# EAGLE design SSTuino (EAGLE 9.2.1)
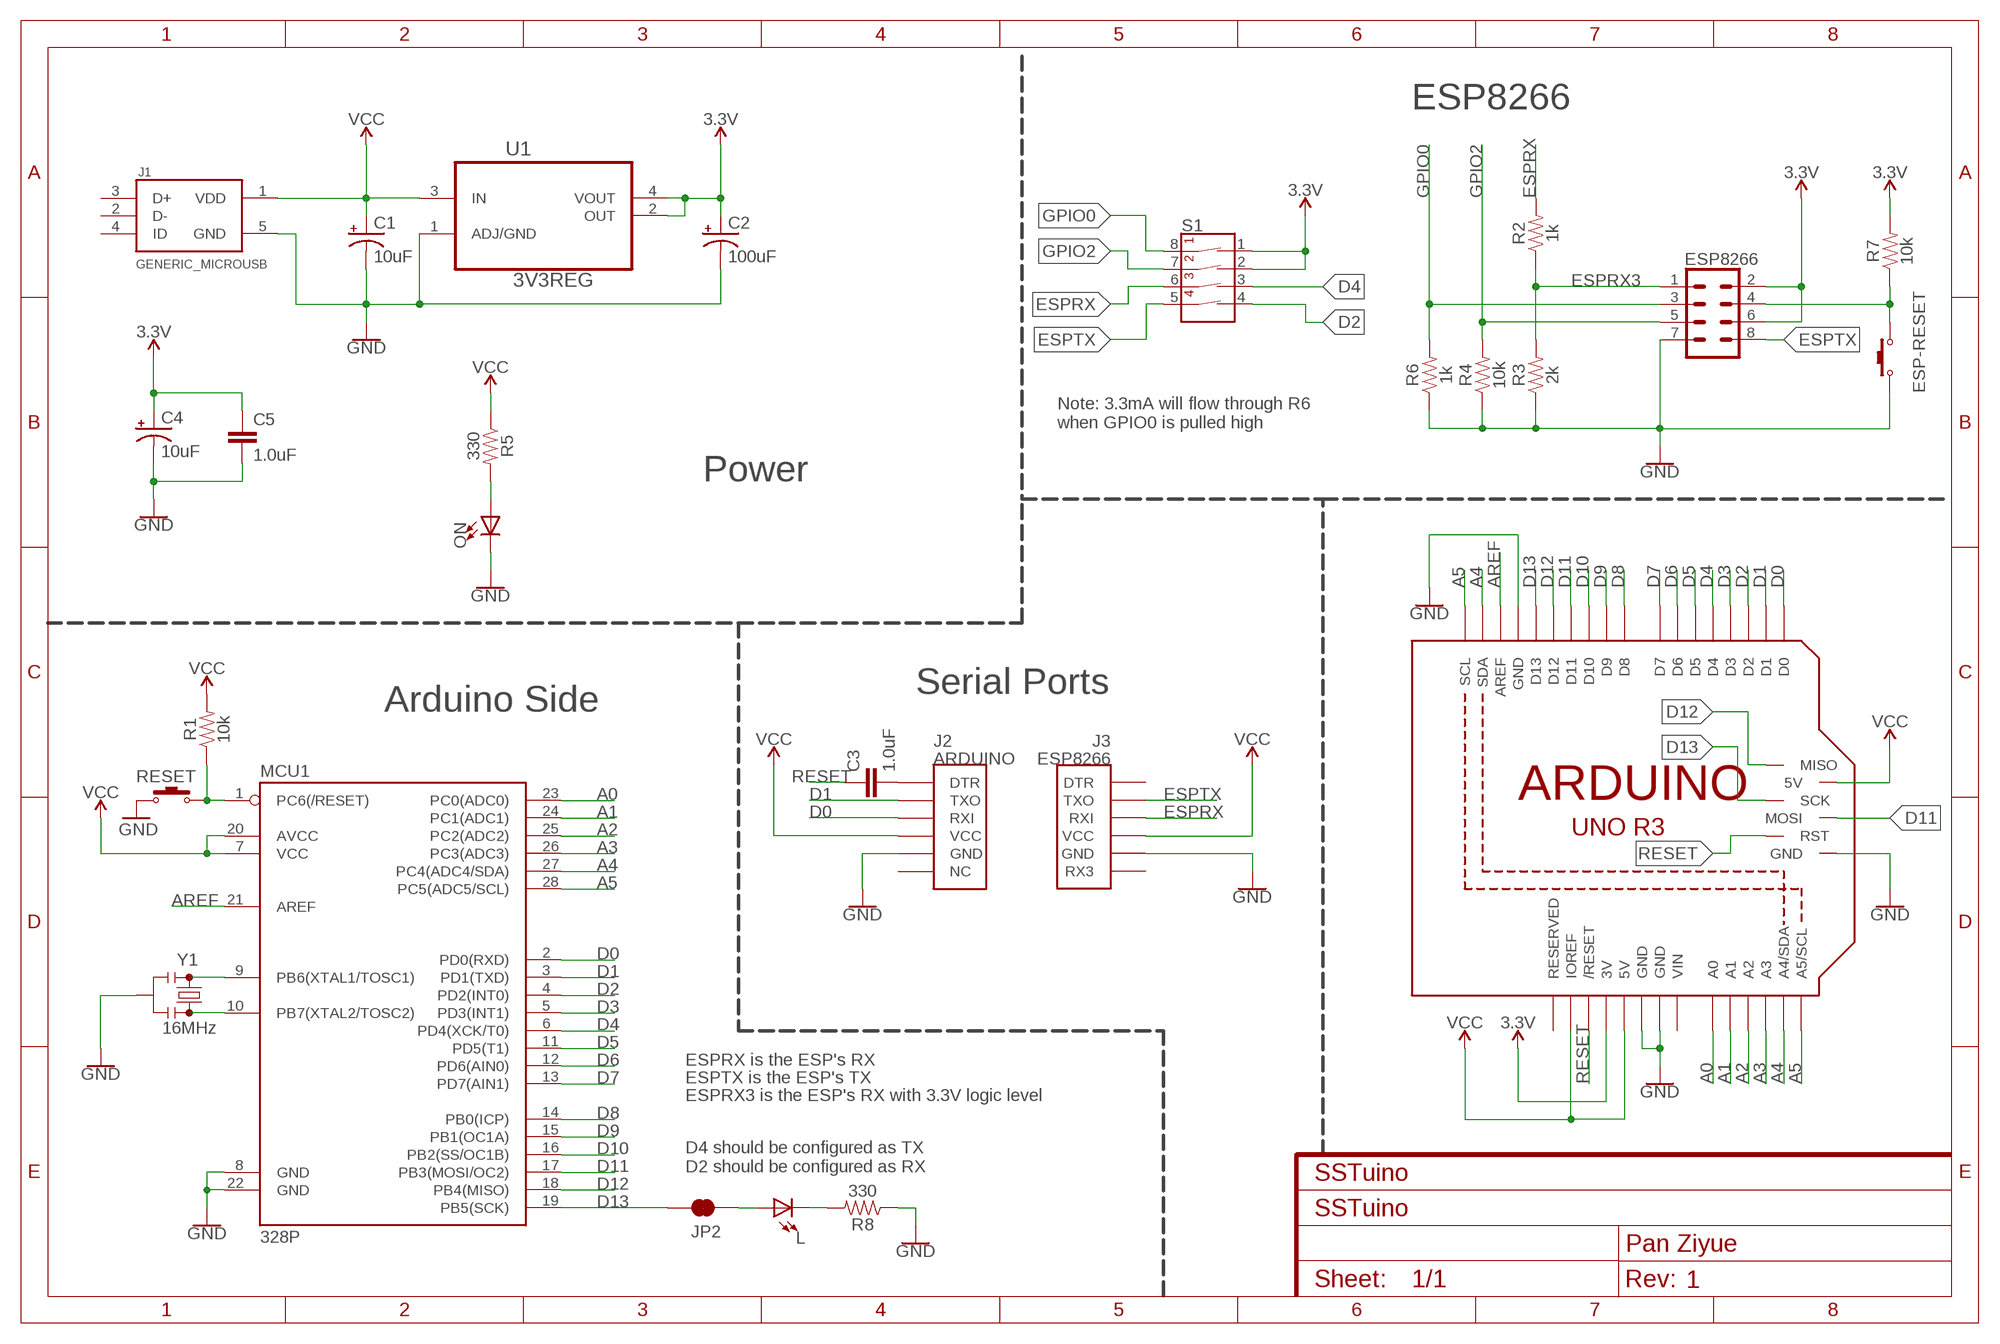
[diagram p0: schematic, sheet 1]
FRAME1 (FRAME-A4L): CNAME: SSTuino; CREVISION: 1; DESIGNER: Pan Ziyue; SPICEPREFIX: X

## Parts
C1  10uF  10UF-POLAR-EIA3528-20V-10%(TANT)  [EIA3528]
C2  100uF  100UF-POLAR-25V-20%(ELEC)  [PANASONIC_D]
C3  1.0uF  1.0UF-1206-50V-10%  [1206]
C4  10uF  10UF-POLAR-EIA3216-16V-10%(TANT)  [EIA3216]
C5  1.0uF  1.0UF-1206-50V-10%  [1206]
ESP8266  CONN_04X2  [2X4]
ESP-RESET  SW-PB_(KAN0641)  [S-SP-4N-KAN0641]
J1  GENERIC_MICROUSB  [FRAMATOME_10118194-0001LF]
J2  ARDUINO  CP2102_DEVICEMICROUSB  [CP2102_DEVICE_MICROUSB]
J3  ESP8266  CP2102_DEVICE_ESP8266  [CP2102_DEVICE_MICROUSB_ESP8266]
JP2  JUMPER-SMT_2_NC_TRACE_SILK  [SMT-JUMPER_2_NC_TRACE_SILK]
L  LED3MM  [LED3MM]
M1  ARDUINO_R3_ICSPSST  [ARDUINOR3_ISCP_SST]
MCU1  328P  ATMEGA328P_PDIP  [DIP28]
ON  LED3MM  [LED3MM]
R1  10k  RESISTOR1206  [1206]
R2  1k  RESISTOR1206  [1206]
R3  2k  RESISTOR1206  [1206]
R4  10k  RESISTOR1206  [1206]
R5  330  RESISTOR1206  [1206]
R6  1k  RESISTOR1206  [1206]
R7  10k  RESISTOR1206  [1206]
R8  330  RESISTOR1206  [1206]
RESET  SW-PB_(KAN0641)  [S-SP-4N-KAN0641]
S1  DIP-04SMD  [DIPSWITCH-04-SMD]
U1  3V3REG  LM1117MP-3.3  [SOT230P696X180-4N]
Y1  16MHz  RESONATOR-16MHZSMD_3.2X1.3  [RESONATOR-SMD-3.2X1.3]

## Nets
3.3V: C2.+ C4.+ C5.1 ESP8266.2 ESP8266.6 M1.3V R7.2 S1.1(1A) S1.2(2A) U1.2(OUT) U1.4(VOUT)
A0: M1.A0 MCU1.23(PC0(ADC0))
A1: M1.A1 MCU1.24(PC1(ADC1))
A2: M1.A2 MCU1.25(PC2(ADC2))
A3: M1.A3 MCU1.26(PC3(ADC3))
A4: M1.A4(A4/SDA) M1.SDA MCU1.27(PC4(ADC4/SDA))
A5: M1.A5(A5/SCL) M1.SCL MCU1.28(PC5(ADC5/SCL))
AREF: M1.AREF MCU1.21(AREF)
D0: J2.RXI M1.D0 MCU1.2(PD0(RXD))
D1: J2.TXO M1.D1 MCU1.3(PD1(TXD))
D2: M1.D2 MCU1.4(PD2(INT0)) S1.4(4A)
D3: M1.D3 MCU1.5(PD3(INT1))
D4: M1.D4 MCU1.6(PD4(XCK/T0)) S1.3(3A)
D5: M1.D5 MCU1.11(PD5(T1))
D6: M1.D6 MCU1.12(PD6(AIN0))
D7: M1.D7 MCU1.13(PD7(AIN1))
D8: M1.D8 MCU1.14(PB0(ICP))
D9: M1.D9 MCU1.15(PB1(OC1A))
D10: M1.D10 MCU1.16(PB2(SS/OC1B))
D11: M1.D11 M1.MOSI MCU1.17(PB3(MOSI/OC2))
D12: M1.D12 M1.MISO MCU1.18(PB4(MISO))
D13: JP2.2 M1.D13 M1.SCK MCU1.19(PB5(SCK))
DTR: C3.2 J2.DTR
ESPRESET: ESP8266.4 ESP-RESET.3 ESP-RESET.4 R7.1
ESPRX: J3.P$4(RXI) R2.2 S1.6(3B)
ESPRX3: ESP8266.1 R2.1 R3.2
ESPTX: ESP8266.8 J3.P$3(TXO) S1.5(4B)
GND: C1.C(-) C2.- C4.- C5.2 ESP8266.7 ESP-RESET.1 ESP-RESET.2 J1.5(GND) J2.GND J3.P$5(GND) M1.GND M1.GND@1(GND) M1.GND@2(GND) M1.GND@3(GND) MCU1.8(GND) MCU1.22(GND) ON.K(C) R3.1 R4.1 R6.1 R8.1 RESET.1 RESET.2 U1.1(ADJ/GND) Y1.2
GPIO0: ESP8266.3 R6.2 S1.8(1B)
GPIO2: ESP8266.5 R4.2 S1.7(2B)
N$1: MCU1.10(PB7(XTAL2/TOSC2)) Y1.3
N$2: L.K(C) R8.2
N$3: JP2.1 L.A
N$4: ON.A R5.2
N$5: MCU1.9(PB6(XTAL1/TOSC1)) Y1.1
RESET: C3.1 M1.RESET(/RESET) M1.RESET_ICSP(RST) MCU1.1(PC6(/RESET)) R1.1 RESET.3 RESET.4
VCC: C1.A(+) J1.1(VDD) J2.5V(VCC) J3.P$6(VCC) M1.5V M1.5V_ICSP(5V) M1.IOREF MCU1.7(VCC) MCU1.20(AVCC) R1.2 R5.1 U1.3(IN)
Unconnected: J1.2(D-) J1.3(D+) J1.4(ID) J2.3V(NC) J3.P$1(RX3) J3.P$2(DTR) M1.RESERVED

## Notes on the sheet
- ESP8266
- Note: 3.3mA will flow through R6 
  when GPIO0 is pulled high
- Power
- Serial Ports
- Arduino Side
- ESPRX is the ESP's RX
- ESPTX is the ESP's TX
- ESPRX3 is the ESP's RX with 3.3V logic level
- D4 should be configured as TX
  D2 should be configured as RX

## Power pins joined to a net without a drawn wire
VIN: M1.VIN

## Library data of the parts
C1 = SparkFun-Capacitors:10UF-POLAR: 10.0µF polarized capacitors A capacitor is a passive two-terminal electrical component used to store electrical energy temporarily in an electric field.; PROD_ID: CAP-08063
C2 = SparkFun-Capacitors:100UF-POLAR: 100µF polarized capacitors A capacitor is a passive two-terminal electrical component used to store electrical energy temporarily in an electric field.; PROD_ID: CAP-12547
C3 = SparkFun-Capacitors:1.0UF: 1µF ceramic capacitors A capacitor is a passive two-terminal electrical component used to store electrical energy temporarily in an electric field.; PROD_ID: CAP-09822
C4 = SparkFun-Capacitors:10UF-POLAR: 10.0µF polarized capacitors A capacitor is a passive two-terminal electrical component used to store electrical energy temporarily in an electric field.; PROD_ID: CAP-00811
C5 = SparkFun-Capacitors:1.0UF: 1µF ceramic capacitors A capacitor is a passive two-terminal electrical component used to store electrical energy temporarily in an electric field.; PROD_ID: CAP-09822; SPICEPREFIX: C
ESP8266 = SparkFun-Connectors:CONN_04X2: Multi connection point. Often used as Generic Header-pin footprint for 0.1 inch spaced/style header connections On any of the 0.1 inch spaced packages, you can populate with these: Break Away Headers - Straight <https://www.sparkfun.com/products/116> (PRT-00116) Break Away Male Headers - Right Angle <https://www.sparkfun.com/products/553> (PRT-00553) Female Headers <https://www.sparkfun.com/products/115> (PRT-00115) Break Away Headers - Machine Pin <https://www.sparkfun.com/products/117> (PRT-00117) Break Away Female Headers - Swiss Machine Pin <https://www.sparkfun.com/products/743> (PRT-00743)
ESP-RESET RESET = Cytron - Others:SW-PB: Momentary Push Button; CYTRON-PC: S-SP-4N-KAN0641; DESC: S Push Button KAN0641 6x6mm (Black); MF: GANGYUAN; MPN: KAN0641-0501B1
J1 = custom:GENERIC_MICROUSB: Conn Micro USB Type B RCP 5 POS 0.65mm Solder RA SMD 5 Terminal 1 Port T/R; AVAILABILITY: Good; DESCRIPTION: Conn Micro USB Type B RCP 5 POS 0.65mm Solder RA SMD 5 Terminal 1 Port T/R; MF: FCI; MP: 10118194-0001LF; PACKAGE: DIP-4 FCI; PRICE: 0.23 USD
J2 = custom:CP2102_DEVICE: Connector which mates to CP2102 basic or CP2102 cable.
J3 = custom:CP2102_DEVICE_ESP8266: Specially made device to mate with CP2102 with a ESP8266 breakout board
JP2 = SparkFun-Jumpers:JUMPER-SMT_2_NC_TRACE: Normally closed trace jumper This jumper has a trace between two pads so it's normally closed (NC). Use a razor knife to open the connection. For best results follow the IPC guidelines for cutting traces: Cutout at least 0.063 mm (0.005 in). Remove all loose material to clean up the cut area. Seal the cut with an approved epoxy. Reapply solder to reclose the connection.
L ON = adafruit:LED: LED OSRAM: - CHIPLED LG R971, LG N971, LY N971, LG Q971, LY Q971, LO R971, LY R971 LH N974, LH R974 LS Q976, LO Q976, LY Q976 LO Q996 - Hyper CHIPLED LW Q18S LB Q993, LB Q99A, LB R99A - SideLED LS A670, LO A670, LY A670, LG A670, LP A670 LB A673, LV A673, LT A673, LW A673 LH A674 LY A675 LS A676, LA A676, LO A676, LY A676, LW A676 LS A679, LY A679, LG A679 - Hyper Micro SIDELED® LS Y876, LA Y876, LO Y876, LY Y876 LT Y87S - SmartLED LW L88C, LW L88S LB L89C, LB L89S, LG L890 LS L89K, LO L89K, LY L89K LS L896, LA L896, LO L896, LY L896 - TOPLED LS T670, LO T670, LY T670, LG T670, LP T670 LSG T670, LSP T670, LSY T670, LOP T670, LYG T670 LG T671, LOG T671, LSG T671 LB T673, LV T673, LT T673, LW T673 LH T674 LS T676, LA T676, LO T676, LY T676, LB T676, LH T676, LSB T676, LW T676 LB T67C, LV T67C, LT T67C, LS T67K, LO T67K, LY T67K, LW E67C LS E67B, LA E67B, LO E67B, LY E67B, LB E67C, LV E67C, LT E67C LW T67C LS T679, LY T679, LG T679 LS T770, LO T770, LY T770, LG T770, LP T770 LB T773, LV T773, LT T773, LW T773 LH T774 LS E675, LA E675, LY E675, LS T675 LS T776, LA T776, LO T776, LY T776, LB T776 LHGB T686 LT T68C, LB T68C - Hyper Mini TOPLED® LB M676 - Mini TOPLED Santana® LG M470 LS M47K, LO M47K, LY M47K Source: http://www.osram.convergy.de/
M1 = custom:ARDUINO_R3_ICSP
MCU1 = SparkFun-IC-Microcontroller:ATMEGA328P_PDIP: Atmel 328P Through hole ATMEGA328P uC used in the Arduino 32kb flash, 1k EEPROM, 2k SRAM Datasheet <http://www.sparkfun.com/datasheets/Components/SMD/ATMega328.pdf> SparkFun Products Storefront component: AVR 28 Pin 20MHz 32K 6A/D - ATMega328P <https://www.sparkfun.com/products/9061> (COM-09061) SparkFun Simon Says - Through-Hole Soldering Kit <https://www.sparkfun.com/products/10547> (KIT-10547) SparkFun Learn to Solder - Simon Says <https://www.sparkfun.com/products/13708> (KIT-13708) SparkFun BigTime Watch Kit <https://www.sparkfun.com/products/11734> (KIT-11734) SparkFun ClockIt <https://www.sparkfun.com/products/10930> (KIT-10930) SparkFun Serial Enabled LCD Kit <https://www.sparkfun.com/products/10097> (LCD-10097) SparkFun Simon Tilts - Through Hole Soldering Kit <https://www.sparkfun.com/products/12634> (KIT-12634) SparkFun Frequency Counter Kit <https://www.sparkfun.com/products/10140> (KIT-10140) FabFM Radio Kit <https://www.sparkfun.com/products/11043> (KIT-11043) SparkFun Binary Blaster Kit <https://www.sparkfun.com/products/12037> (KIT-12037) SparkFun Metro-Gnome <https://www.sparkfun.com/products/9236> (KIT-09236) ATmega328 with Arduino Optiboot (Uno) <https://www.sparkfun.com/products/10524> (DEV-10524); PROD_ID: IC-09136
R1-R8 = SparkFun-Resistors:RESISTOR: Generic Resistor Package
S1 = SparkFun-Switches:DIP-04: 4-Position DIP Switch 4-circuit DIP (dual inline package) switch. Commonly used to physcially set a circuit's behavior. SparkFun Products Prototype Part; PROD_ID: SWCH-12418; SPICEPREFIX: X
U1 = custom:LM1117MP-3.3: Linear regulators; MPN: LM1117MP-3.3; OC_FARNELL: 9778195; OC_NEWARK: 41K3470; PACKAGE: SOT223-3; SUPPLIER: NationalSemiconductor
Y1 = SparkFun-Clocks:RESONATOR-16MHZ: 16MHz Resonator Digikey Example <http://www.digikey.com/product-detail/en/murata-electronics-north-america/CSTCE16M0V53-R0/490-1198-1-ND/584635> Frequency: 16MHz Frequency Stability: ±0.3% Frequency Tolerance: ±0.5% Capacitance: 15pF SparkFun Products SparkFun OpenLog <https://www.sparkfun.com/products/13712> SparkFun MicroView - OLED Arduino Module <https://www.sparkfun.com/products/12923>; PROD_ID: XTAL-08900

## Board
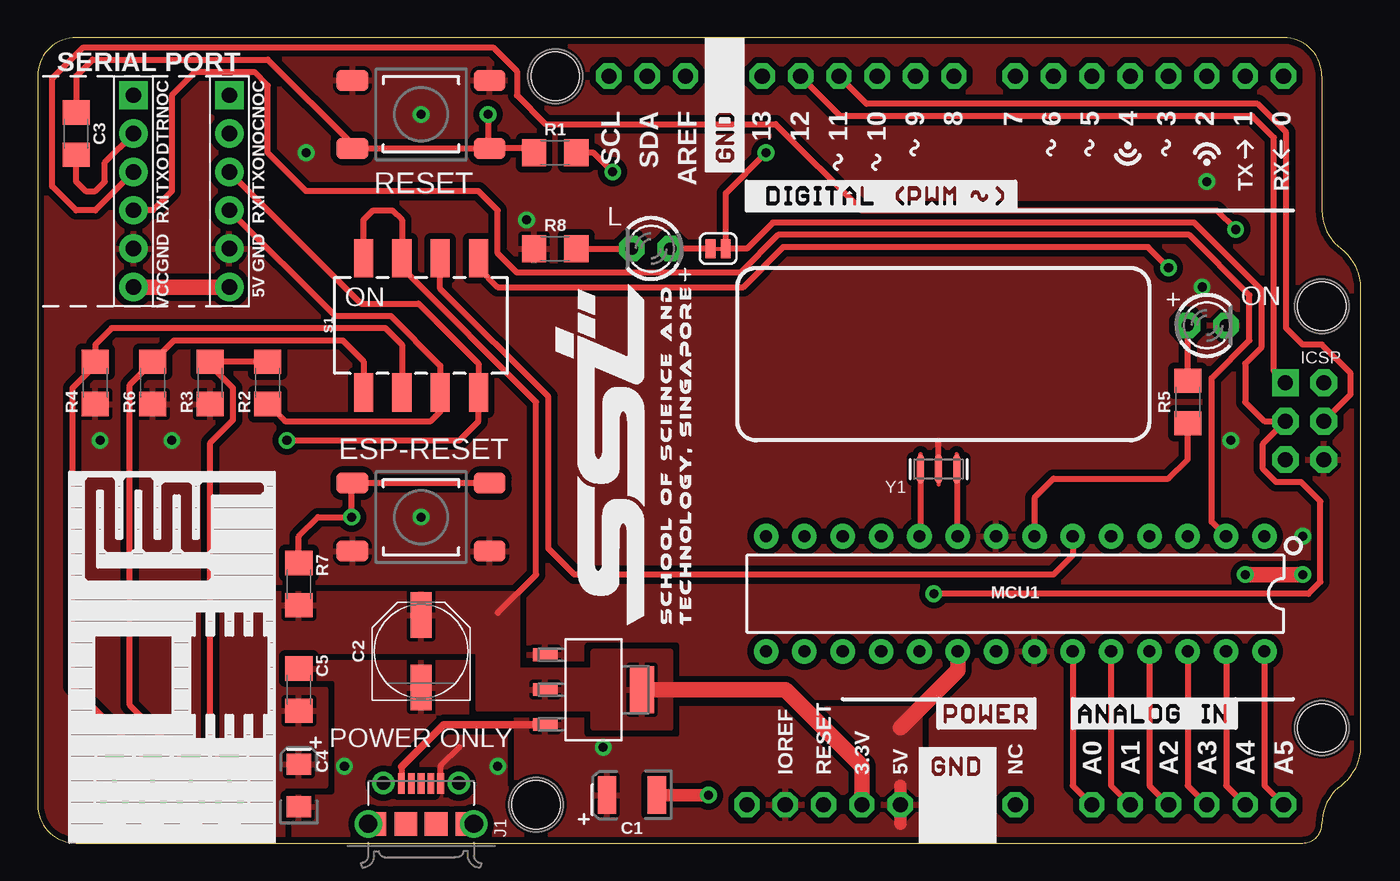
[diagram p1: board, top side]
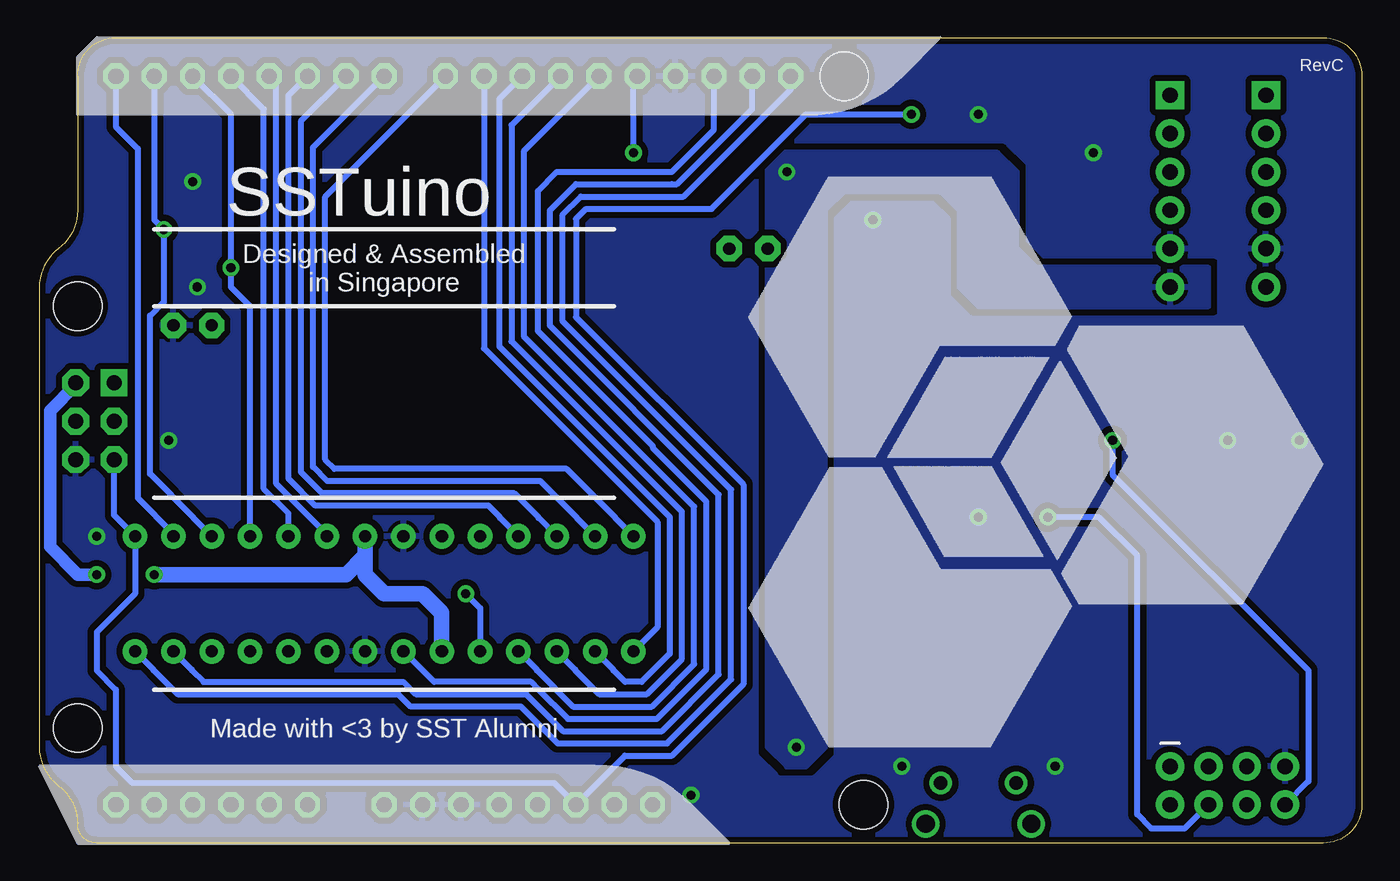
[diagram p2: board, bottom side, seen from below]

Size 87.63 x 53.34 mm. Coordinates in mm from the lower left corner, seen from the top.
Copper layers (1*16): Top 0.035mm / dielectric 1.5mm / Bottom 0.035mm
Design rules "SparkFun *": minimum track width 8mil, minimum drill 20mil, track to track 16mil, track to pad 8mil, pad to pad 8mil, via to via 8mil, smd to smd 8mil, copper to edge 10mil, drill to drill 8mil, minimum pad ring 12mil, minimum via ring 10mil, stop-mask expansion 4mil, vias tented up to drill 25mil, thermal gap 10mil

### Footprints (pad centres in the part's own frame; a part is rotated, then mirrored left to right if it is on the bottom)
EIA3528 = smd 1.2 x 2.5: A 1.65,0; C -1.65,0
PANASONIC_D = smd 3 x 1.4: + 2.4,0; - -2.4,0
1206 = smd 1.6 x 1.8: 1 -1.4,0; 2 1.4,0
EIA3216 = smd 1.4 x 1.6: + 1.4,0; - -1.4,0
2X4 = drill 1.016 pad 1.88: 1 -3.81,-1.27; 2 -3.81,1.27; 3 -1.27,-1.27; 4 -1.27,1.27; 5 1.27,-1.27; 6 1.27,1.27; 7 3.81,-1.27; 8 3.81,1.27
S-SP-4N-KAN0641 = smd 2.1 x 1.4: 1 -4.55,-2.25; 2 4.55,-2.25; 3 4.55,2.25; 4 -4.55,2.25
FRAMATOME_10118194-0001LF = smd 0.45 x 1.35: 1 -1.3,2.675; 2 -0.65,2.675; 3 0,2.675; 4 0.65,2.675; 5 1.3,2.675 | drill 0.9: P$6 -2.5,2.7; P$7 2.5,2.7 | drill 1.2: P$8 -3.5,0; P$9 3.5,0 | smd 1.5 x 1.55: P$10 -1,0; P$11 1,0; P$12 -3.05,0; P$13 3.05,0
CP2102_DEVICE_MICROUSB = drill 1.016 pad 1.88 square: 3V -6.35,0 | drill 1.016 pad 1.88: 5V 6.35,0; DTR -3.81,0; GND 3.81,0; RXI 1.27,0; TXO -1.27,0
CP2102_DEVICE_MICROUSB_ESP8266 = drill 1.016 pad 1.88 square: P$1 -6.35,0 | drill 1.016 pad 1.88: P$2 -3.81,0; P$3 -1.27,0; P$4 1.27,0; P$5 3.81,0; P$6 6.35,0
SMT-JUMPER_2_NC_TRACE_SILK = smd 0.635 x 1.27: 1 -0.508,0; 2 0.508,0
LED3MM = drill 0.813 pad 1.676 octagon: A -1.27,0; K 1.27,0
ARDUINOR3_ISCP_SST = drill 1 pad 1.676 octagon: 3V 54.61,2.54; 5V 57.15,2.54; A0 69.85,2.54; A1 72.39,2.54; A2 74.93,2.54; A3 77.47,2.54; A4 80.01,2.54; A5 82.55,2.54; AREF 42.926,50.8; D0 82.55,50.8; D1 80.01,50.8; D2 77.47,50.8; D3 74.93,50.8; D4 72.39,50.8; D5 69.85,50.8; D6 67.31,50.8; D7 64.77,50.8; D8 60.706,50.8; D9 58.166,50.8; D10 55.626,50.8; D11 53.086,50.8; D12 50.546,50.8; D13 48.006,50.8; GND 45.466,50.8; GND@1 62.23,2.54; GND@2 59.69,2.54; IOREF 49.53,2.54; RESERVED 46.99,2.54; RESET 52.07,2.54; SCL 37.846,50.8; SDA 40.386,50.8; VIN 64.77,2.54 | drill 1 pad 1.778 octagon: 5V_ICSP 85.217,30.48; GND@3 85.217,25.4; MOSI 85.217,27.94; RESET_ICSP 82.677,25.4; SCK 82.677,27.94 | drill 1 pad 1.778 square: MISO 82.677,30.48 | hole 3.2: 34.29,50.8; 85.09,35.56; 85.09,7.62; 33.02,2.54
DIP28 = drill 0.813 pad 1.626: 1 -16.51,-3.81; 2 -13.97,-3.81; 3 -11.43,-3.81; 4 -8.89,-3.81; 5 -6.35,-3.81; 6 -3.81,-3.81; 7 -1.27,-3.81; 8 1.27,-3.81; 9 3.81,-3.81; 10 6.35,-3.81; 11 8.89,-3.81; 12 11.43,-3.81; 13 13.97,-3.81; 14 16.51,-3.81; 15 16.51,3.81; 16 13.97,3.81; 17 11.43,3.81; 18 8.89,3.81; 19 6.35,3.81; 20 3.81,3.81; 21 1.27,3.81; 22 -1.27,3.81; 23 -3.81,3.81; 24 -6.35,3.81; 25 -8.89,3.81; 26 -11.43,3.81; 27 -13.97,3.81; 28 -16.51,3.81
DIPSWITCH-04-SMD = smd 1.27 x 2.54: 1 -3.81,4.445; 2 -1.27,4.445; 3 1.27,4.445; 4 3.81,4.445; 5 3.81,-4.445; 6 1.27,-4.445; 7 -1.27,-4.445; 8 -3.81,-4.445
SOT230P696X180-4N = smd 1.6 x 0.838: 1 -3.2,2.311; 2 -3.2,0; 3 -3.2,-2.311 | smd 1.6 x 3.099: 4 3.2,0
RESONATOR-SMD-3.2X1.3 = smd 0.45 x 1.905: 1 -1.2,0; 2 0,0; 3 1.2,0

### Placement (x,y rotation side)
C1  39.37,3.17 180 top
C2  25.4,12.7 90 top
C3  2.54,46.99 270 top
C4  17.3,3.81 90 top
C5  17.3,10.16 90 top
ESP8266  8.89,3.81 180 top
ESP-RESET  25.4,21.59 0 top
J1  25.4,1.27 0 top
J2  6.35,43.18 270 top
J3  12.7,43.18 270 top
JP2  45.09,39.37 0 top
L  40.64,39.37 180 top
M1  0,0 0 top
MCU1  64.77,16.51 180 top
ON  77.47,34.29 0 top
R1  34.29,45.72 0 top
R2  15.24,30.48 270 top
R3  11.43,30.48 90 top
R4  3.81,30.48 90 top
R5  76.2,29.21 90 top
R6  7.62,30.48 90 top
R7  17.3,17.14 270 top
R8  34.29,39.37 0 top
RESET  25.4,48.26 180 top
S1  25.4,34.29 0 top
U1  36.83,10.16 0 top
U$1  [ESP8266-NEGASILK]  8.89,0.64 0 top
U$2  [SST-MED]  43.81,13.65 90 top
U$3  [SST-HEXAGON-INV-BMP]  40.64,6.35 0 top
Y1  59.69,24.77 180 top

### Tracks (layer width: path | path; a pad name or v marks a point on that pad's centre or on a via)
3.3V
  Top 0.406: S1.1 21.59,41.27 22.23,41.91 23.5,41.91 24.13,41.27 S1.2 24.13,38.1 33.02,29.21 33.02,17.78 30.48,15.24
  Top 1.016: M1.3V 54.61,5.08 49.53,10.16 U1.4
  pour Top (isolate 0.406): 7.62,0 7.62,16.51 31.75,16.51 31.75,11.43 36.83,11.43 36.83,12.7 41.91,12.7 41.91,7.62 36.83,7.62 36.83,8.89 29.21,8.89 29.21,12.7 16.19,12.7 16.19,10.16 19.05,10.16 19.05,3.81 16.19,3.81 16.19,0
A0
  Top 0.406: MCU1.23 68.58,3.81 M1.A0
A1
  Top 0.406: MCU1.24 71.12,3.81 M1.A1
A2
  Top 0.406: MCU1.25 73.66,3.81 M1.A2
A3
  Top 0.406: MCU1.26 76.2,3.81 M1.A3
A4
  Top 0.406: MCU1.27 78.74,3.81 M1.A4
  Bottom 0.406: MCU1.27 77.52,11.48 77.52,11.44 76.75,10.67 63.5,10.67 62.69,9.86 55.37,9.86 52.94,7.42 46.37,7.42 42.61,11.18 42.61,23.08 53.8,34.27 53.8,41.91 52.07,43.64 45.72,43.64 45.38,43.64 40.39,48.63 M1.SDA
A5
  Top 0.406: MCU1.28 81.28,3.81 M1.A5
  Bottom 0.406: MCU1.28 80.06,11.48 80.06,11.44 78.47,9.86 63.84,9.86 63.02,9.04 55.71,9.04 53.27,6.6 46.03,6.6 41.8,10.84 41.8,23.41 52.98,34.6 52.98,41.57 51.73,42.82 44.93,42.82 37.85,49.91 M1.SCL
AREF
  Bottom 0.406: M1.AREF 42.93,47.24 45.72,44.45 53.34,44.45 54.61,43.18 54.61,33.93 46.99,26.31 46.99,26.19 43.42,22.62 43.42,11.51 46.7,8.23 52.6,8.23 54.57,10.2 55.04,10.67 61.47,10.67 MCU1.21
D0
  Top 0.406: MCU1.2 77.79,21.27 77.79,30.8 80.29,33.3 80.29,36.29 76.3,40.28 49.05,40.28 46.55,37.78 31.75,37.78 30.48,39.05 30.48,41.91 29.21,43.18 17.78,43.18 15.24,45.72 15.24,50.16 14.33,51.08 10.44,51.08 8.89,49.53 8.89,43.18 7.62,41.91 J2.RXI
  Bottom 0.406: M1.D0 82.55,47.45 81.1,46 81.1,22.86 78.74,20.5 MCU1.2
D1  (via drill 0.6)
  Top 0.406: v79.38,40.64 78.11,41.91 54.61,41.91 48.9,47.62 33.66,47.62 31.75,49.53 31.75,51.12 30.16,52.7 3.02,52.7 1.19,50.88 1.03,50.71 0.95,50.63 0.95,43.5 2.54,41.91 3.81,41.91 J2.TXO
  Bottom 0.406: MCU1.3 77.42,21.54 77.42,21.58 80.29,24.45 80.29,34.93 79.38,35.85 v79.38,40.64 80.01,41.27 M1.D1
D2  (via drill 0.6)
  Top 0.406: v74.93,38.1 73.56,39.47 49.39,39.47 46.75,36.83 30.48,36.83 29.21,38.1 S1.4
  Bottom 0.406: MCU1.4 73.66,35.56 74.93,36.83 v74.93,38.1 74.93,48.26 M1.D2
D3
  Bottom 0.406: MCU1.5 71.12,21.83 72.75,23.46 72.75,48.62 M1.D3
D4
  Top 0.406: MCU1.6 68.58,19.05 67.31,17.78 35.56,17.78 33.83,19.51 33.83,29.55 26.67,36.71 S1.3
  Bottom 0.406: MCU1.6 68.58,20.44 71.93,23.79 71.93,50.34 M1.D4
D5
  Bottom 0.406: MCU1.11 57.1,21.54 57.1,21.58 57.87,22.35 69.34,22.35 71.12,24.13 71.12,49.53 M1.D5
D6
  Bottom 0.406: MCU1.12 54.56,21.54 54.56,21.58 56.15,23.16 68.89,23.16 70.31,24.59 70.31,47.8 M1.D6
D7
  Bottom 0.406: MCU1.13 52.02,21.54 52.02,21.58 54.42,23.98 68.55,23.98 69.49,24.92 69.49,46.08 M1.D7
D8
  Bottom 0.406: MCU1.14 49.48,21.54 49.48,21.58 52.69,24.79 68.07,24.79 68.68,25.4 68.68,42.82 M1.D8
D9
  Bottom 0.406: MCU1.15 46.67,14.29 46.67,21.27 58.17,32.77 M1.D9
D10
  Bottom 0.406: MCU1.16 49.58,11.48 49.58,11.44 48.81,10.67 47.71,10.67 45.86,12.52 45.86,21.61 57.15,32.9 57.15,33.02 57.15,49.28 M1.D10
D11
  Top 0.406: M1.MOSI 87,29.72 87,31.11 85.09,33.02 83.82,33.02 82.73,34.11 82.73,47.07 80.83,48.97 54.92,48.97 M1.D11
  Bottom 0.406: MCU1.17 52.12,11.48 52.12,11.44 50.53,9.86 47.38,9.86 45.05,12.19 45.05,21.95 56.34,33.24 56.34,47.55 M1.D11
D12
  Top 0.406: M1.MISO 81.92,31.24 81.92,46.73 80.49,48.15 53.19,48.15 M1.D12
  Bottom 0.406: MCU1.18 54.66,11.48 54.66,11.44 52.26,9.04 47.04,9.04 44.23,11.85 44.23,22.28 55.52,33.57 55.52,45.82 M1.D12
D13  (via drill 0.6)
  Top 0.406: v59.37,16.51 84.2,16.51 84.98,17.3 84.98,22.64 83.72,23.9 82.06,23.9 81.18,24.78 81.18,26.44 M1.SCK 81.28,27.94 80.01,29.21 80.01,31.75 81.1,32.84 81.1,36.63 76.63,41.1 48.72,41.1 46.99,39.37 JP2.2 45.59,43.05 v48.26,45.72
  Bottom 0.406: v48.26,45.72 48.26,50.55 M1.D13 | v59.37,16.51 58.42,15.56 MCU1.19
DTR
  Top 0.406: J2.DTR 4.45,45.09 4.45,43.81 3.81,43.18 3.17,43.18 2.54,43.81 C3.2
ESPRESET  (via drill 0.6)
  Top 0.406: ESP-RESET.3 ESP-RESET.4 20.8,23.79 v20.8,21.59 18.57,21.59 17.3,20.32 R7.1
  Bottom 0.406: ESP8266.4 11.75,0.95 13.97,0.95 13.97,0.98 14.88,1.9 14.88,19.05 17.42,21.59 v20.8,21.59
ESPRX
  Top 0.406: R2.2 16.38,27.94 26.04,27.94 26.67,28.57 S1.6 26.67,31.63 23.38,34.91 19.7,34.91 J3.P$4
ESPRX3
  Top 0.406: ESP8266.1 11.43,6.35 11.43,26.52 12.94,28.03 12.94,30.13 11.43,31.64 R3.2 R2.1
ESPTX  (via drill 0.6)
  Top 0.406: v16.51,26.67 27.94,26.67 29.21,27.94 S1.5 29.21,31.75 26.04,34.92 25.23,35.73 21.42,35.73 J3.P$3
  Bottom 0.406: ESP8266.8 3.53,4.09 3.53,11.43 16.51,24.41 v16.51,26.67
GND  (via drill 0.6)
  Top 0.406: Y1.2 59.69,26.67 | J1.5 26.7,5.11 27.94,6.35
  Top 0.813: C1.C v44.45,3.17
  other vias: 8.89,26.67 83.82,20.32 79.06,26.67 30.48,5.08 25.4,48.26 25.4,21.59 32.38,41.27 4.13,26.67 20.32,5.08 17.78,45.72 77.47,43.81 77.15,36.83
  pour Bottom (isolate 0.406, rank 2): 0,0 85.09,0 85.09,2.54 87.63,5.08 87.63,38.1 85.09,40.64 85.09,52.07 83.82,53.34 0,53.34
  pour Top (isolate 0.406, rank 3): 0,0 85.09,0 85.09,2.54 87.63,5.08 87.63,38.1 85.09,40.64 85.09,52.07 83.82,53.34 0,53.34
GPIO0
  Top 0.406: ESP8266.3 6.11,9.13 6.11,30.37 R6.2 9.03,33.29 20.21,33.29 21.59,31.91 S1.8
GPIO2
  Top 0.406: ESP8266.5 2.3,10.4 2.3,30.13 3.81,31.64 R4.2 3.81,33.02 4.89,34.1 23.05,34.1 24.13,33.02 S1.7
N$1
  Top 0.406: Y1.3 58.49,20.39 MCU1.10
N$2
  Top 0.406: R8.2 L.K
N$3
  Top 0.406: JP2.1 L.A
N$4
  Top 0.406: R5.2 76.2,34.06 ON.A
N$5
  Top 0.406: Y1.1 60.89,20.39 MCU1.9
RESET  (via drill 0.6)
  Top 0.406: 29.21,46.01 RESET.3 20.85,46.28 15.24,51.89 3.63,51.89 2.54,50.8 C3.1 | 29.21,46.01 RESET.4 32.6,46.01 R1.1 | v29.84,48.26 29.84,46.65 29.21,46.01
  Bottom 0.406: M1.RESET_ICSP 82.68,21.72 MCU1.1 81.28,16.51 83.82,13.97 83.82,11.43 82.55,10.16 82.55,5.08 81.46,3.99 53.52,3.99 M1.RESET 48.82,5.79 45.69,5.79 41.62,9.87 41.25,10.23 40.98,10.5 40.98,23.75 52.07,34.84 52.07,41.34 51.4,42.01 43.08,42.01 36.83,48.26 v29.84,48.26
VCC  (via drill 0.6)
  Top 0.406: 24.1,5.05 J1.1 | v38.1,44.45 36.83,45.72 R1.2 | MCU1.7 66.04,22.86 67.31,24.13 74.93,24.13 76.2,25.4 R5.1
  Top 0.508: U1.3 26.9,7.85 24.1,5.05
  Top 0.813: 57.15,3.81 M1.5V 57.15,1.27
  Top 1.016: v83.82,17.78 v80.01,17.78 | MCU1.20 60.96,11.43 57.15,7.62 | J2.5V J3.P$6
  Bottom 0.813: M1.5V_ICSP 85.22,30.35 86.92,28.64 86.92,19.61 85.09,17.78 v83.82,17.78
  Bottom 1.016: MCU1.20 60.96,15.24 62.23,16.51 64.77,16.51 66.04,17.78 66.04,19.05 | 66.04,19.05 MCU1.7 | v80.01,17.78 67.31,17.78 66.04,19.05
  other vias: 37.47,6.35
  pour Top (isolate 0.406, rank 2): 31.75,8.89 58.42,8.89 58.42,0 31.75,0
  pour Bottom (isolate 0.406): 10.16,35.56 10.16,38.1 21.59,38.1 22.86,39.37 22.86,44.45 24.13,45.72 39.37,45.72 39.37,6.35 38.1,5.08 36.83,5.08 35.56,6.35 35.56,41.91 34.29,43.18 27.94,43.18 26.67,41.91 26.67,36.83 25.4,35.56

### Text on the board
tPlace: SERIAL PORT | TX | RX | ON | ICSP | POWER ONLY
bPlace: RevC | SSTuino | Designed & Assembled / in Singapore | Made with <3 by SST Alumni